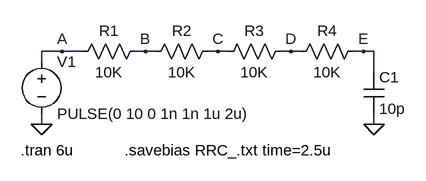
[diagram p0: schematic Fig_3-39_savebias_RRC.asc]
Fig_3-39_savebias_RRC.asc, the LTspice schematic file:
Version 4
SHEET 1 880 680
WIRE 16 160 -16 160
WIRE 48 160 16 160
WIRE 144 160 128 160
WIRE 160 160 144 160
WIRE 256 160 240 160
WIRE 272 160 256 160
WIRE 368 160 352 160
WIRE 384 160 368 160
WIRE 480 160 464 160
WIRE 496 160 480 160
WIRE -16 176 -16 160
WIRE 496 192 496 160
WIRE -16 272 -16 256
WIRE 496 272 496 256
FLAG 496 272 0
FLAG -16 272 0
FLAG 16 160 A
FLAG 144 160 B
FLAG 256 160 C
FLAG 368 160 D
FLAG 480 160 E
SYMBOL res 32 176 R270
WINDOW 0 32 56 VTop 2
WINDOW 3 0 56 VBottom 2
SYMATTR InstName R1
SYMATTR Value 10K
SYMBOL cap 480 192 R0
SYMATTR InstName C1
SYMATTR Value 10p
SYMBOL voltage -16 160 R0
WINDOW 123 0 0 Left 2
WINDOW 39 0 0 Left 2
SYMATTR InstName V1
SYMATTR Value PULSE(0 10 0 1n 1n 1u 2u)
SYMBOL res 144 176 R270
WINDOW 0 32 56 VTop 2
WINDOW 3 0 56 VBottom 2
SYMATTR InstName R2
SYMATTR Value 10K
SYMBOL res 256 176 R270
WINDOW 0 32 56 VTop 2
WINDOW 3 0 56 VBottom 2
SYMATTR InstName R3
SYMATTR Value 10K
SYMBOL res 368 176 R270
WINDOW 0 32 56 VTop 2
WINDOW 3 0 56 VBottom 2
SYMATTR InstName R4
SYMATTR Value 10K
TEXT -48 312 Left 2 !.tran 6u
TEXT 112 312 Left 2 !.savebias RRC_.txt time=2.5u

The netlist it stands for:
* Fig_3-39_savebias_RRC.asc
R1 A B 10K
C1 E 0 10p
V1 A 0 PULSE(0 10 0 1n 1n 1u 2u)
R2 B C 10K
R3 C D 10K
R4 D E 10K
.tran 6u
.savebias RRC_.txt time=2.5u
.backanno
.end